# Altium project PCB_Project_2.PrjPcb
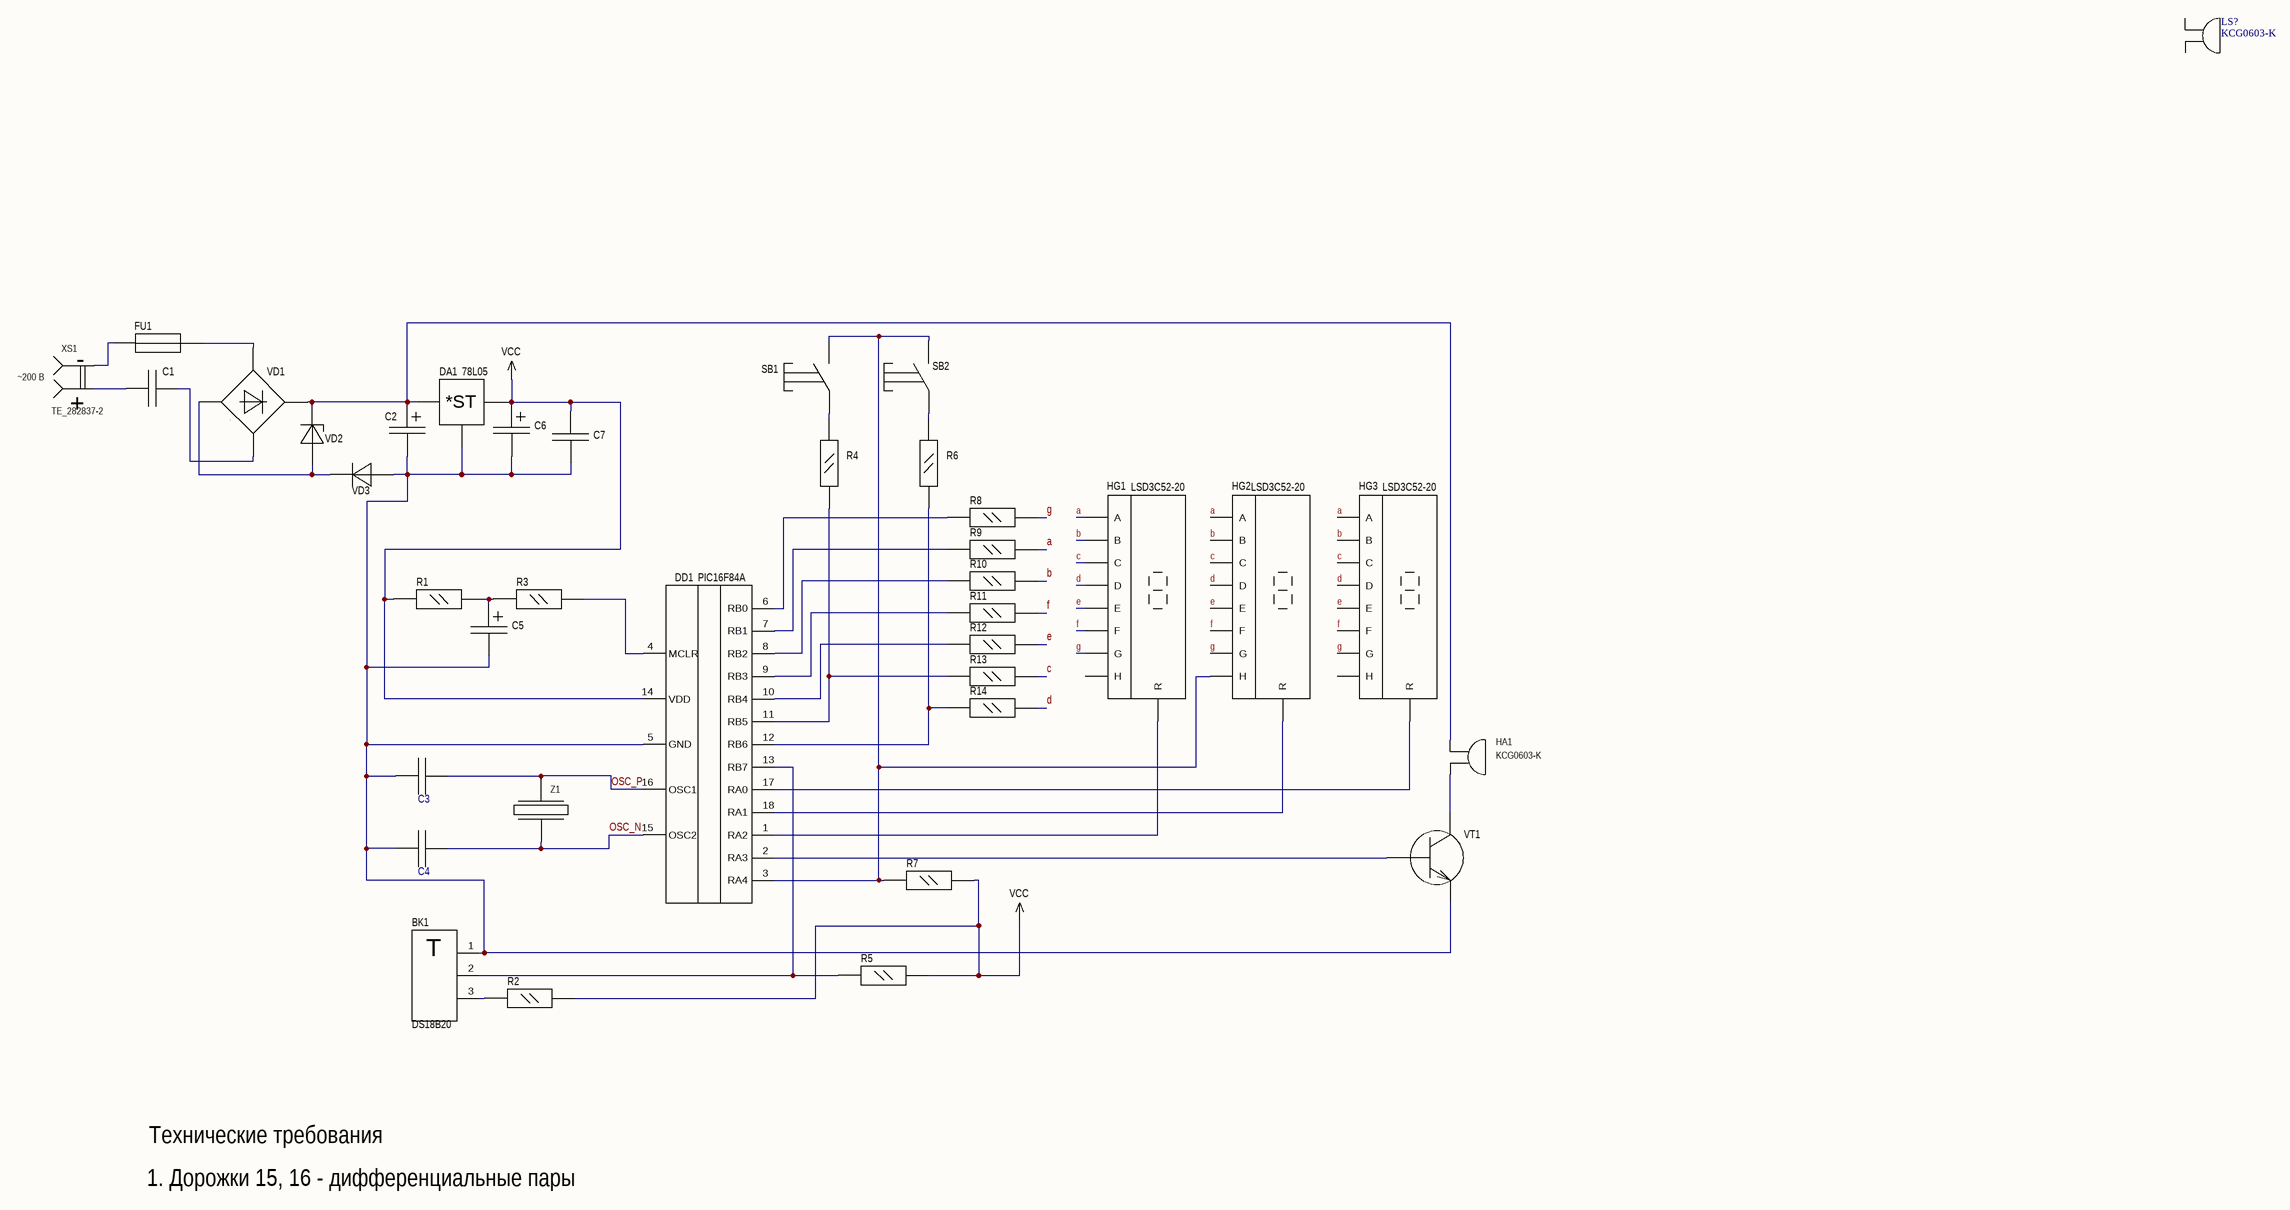
[diagram p0: RomanK1.SchDoc]
1 sheet, 38 parts. Net scope: global (net labels, ports and power ports of the same name join across sheets).
Board file: PCB1.PcbDoc

## Sheet RomanK1.SchDoc: Датчик
size 420 x 297 mm; ApprovedBy: Исаев; CheckedBy: Исаев; DrawnBy: Колганов; Organization: МАИ; DocumentNumber: МВАУ.405113.008 Э3; SheetNumber: 1; SheetTotal: 1; Title1str: температуры; DocumentType: Схема электрическая принципиальная; Format: A3; ImagePath: МВАУ.405113.008

### Parts
BK1  DS18B20  [ds18b20 (Temperature)]
C1  CapacitorBI  [c1 1uF 400v]  (value not drawn)
C2  CapcatiorPOL  [c2 CAP ALUM 470UF 20% 25V SMD]  (value not drawn)
C3  CapacitorBI  [c3 c4 CAPC1608X90]  (value not drawn)
C4  CapacitorBI  [c3 c4 CAPC1608X90]  (value not drawn)
C5  CapcatiorPOL  [Polar CAPACITOR]  (value not drawn)
C6  CapcatiorPOL  [c6 CAP ALUM 1000UF 20% 16V SMD]  (value not drawn)
C7  CapacitorBI  [CAPACITOR]  (value not drawn)
DA1  78L05  [78lo5]
DD1  PIC16F84A  [PIC16F84A]
FU1  Fuse box  [SMD06025C2 (Плавкий предохранитель)]  (value not drawn)
HA1  KCG0603-K  [KCG0603-K Пищалка]
HG1  LSD3C52-20  [LSD3C52-20 (7 segment)]
HG2  LSD3C52-20  [LSD3C52-20 (7 segment)]
HG3  LSD3C52-20  [LSD3C52-20 (7 segment)]
LS?  KCG0603-K  [KCG0603-K Пищалка]
R1  resistor  [RES 0805]  (value not drawn)
R2  resistor  [RES 0805]  (value not drawn)
R3  resistor  [RES 0805]  (value not drawn)
R4  resistor  [RES 0805]  (value not drawn)
R5  resistor  [RES 0805]  (value not drawn)
R6  resistor  [RES 0805]  (value not drawn)
R7  resistor  [RES 0805]  (value not drawn)
R8  resistor  [RES 0805]  (value not drawn)
R9  resistor  [RES 0805]  (value not drawn)
R10  resistor  [RES 0805]  (value not drawn)
R11  resistor  [RES 0805]  (value not drawn)
R12  resistor  [RES 0805]  (value not drawn)
R13  resistor  [RES 0805]  (value not drawn)
R14  resistor  [RES 0805]  (value not drawn)
SB1  Button  [SW_800AWSP9M2QE (button)]  (value not drawn)
SB2  Button  [SW_800AWSP9M2QE (button)]  (value not drawn)
VD1  diode bridge  [КЦ407А (Диодный мост)]  (value not drawn)
VD2  Stabilitron  [Стабилитрон DIOM5436X247N]  (value not drawn)
VD3  Diod  [Диод US1A-13-F]  (value not drawn)
VT1  transistor  [КТ315Б]  (value not drawn)
XS1  TE_282837-2  [Питание TE_282837-2]
Z1  kwarz  [Кварц  hc-49sm]  (value not drawn)

### Nets
VCC: C6.1 C7.1 DA1.1(out) DD1.14(VDD) R1.2 R2.1 R5.1 R7.1
a: HG1.1(A) HG2.1(A) HG3.1(A) R9.1
b: HG1.10(B) HG2.10(B) HG3.10(B) R10.1
c: HG1.8(C) HG2.8(C) HG3.8(C) R13.1
d: HG1.5(D) HG2.5(D) HG3.5(D) R14.1
e: HG1.4(E) HG2.4(E) HG3.4(E) R12.1
f: HG1.2(F) HG2.2(F) HG3.2(F) R11.1
g: HG1.3(G) HG2.3(G) HG3.3(G) R8.1
OSC_N: C4.2 DD1.15(OSC2) Z1.2
OSC_P: C3.1 DD1.16(OSC1) Z1.1
NetBK1_1: BK1.1(GND) C2.2 C3.2 C4.1 C5.2 C6.2 C7.2 DA1.2(gnd) DD1.5(GND) VD3.1 VT1.3
NetBK1_2: BK1.2(DQ) DD1.13(RB7) R5.2
NetBK1_3: BK1.3(VDD) R2.2
NetC1_1: C1.1 XS1.2(+)
NetC1_2: C1.2 VD1.5
NetC2_1: C2.1 DA1.3(in) HA1.1(POS) VD1.4(3_or_4) VD2.2
NetC5_1: C5.1 R1.1 R3.2
NetDD1_1: DD1.1(RA2) HG1.6(R)
NetDD1_2: DD1.2(RA3) VT1.1
NetDD1_3: DD1.3(RA4) HG2.7(H) R7.2 SB1.2 SB2.2
NetDD1_4: DD1.4(MCLR) R3.1
NetDD1_6: DD1.6(RB0) R8.2
NetDD1_7: DD1.7(RB1) R9.2
NetDD1_8: DD1.8(RB2) R10.2
NetDD1_9: DD1.9(RB3) R11.2
NetDD1_10: DD1.10(RB4) R12.2
NetDD1_11: DD1.11(RB5) R4.2 R13.2
NetDD1_12: DD1.12(RB6) R6.2 R14.2
NetDD1_17: DD1.17(RA0) HG3.6(R)
NetDD1_18: DD1.18(RA1) HG2.6(R)
NetFU1_1: FU1.1 XS1.1(-)
NetFU1_2: FU1.2 VD1.2
NetHA1_2: HA1.2(NEG) VT1.2
NetR4_1: R4.1 SB1.1
NetR6_1: R6.1 SB2.1
NetVD1_1: VD1.1(1_or_6) VD2.1 VD3.2

Not connected (* = marked no-connect by the designer): HG1 7(H); HG3 7(H); LS? 1(POS) 2(NEG)

### Notes on the sheet
- (near XS1) ~200 В
- Технические требования
- 1. Дорожки 15, 16 - дифференциальные пары
- Перв. примен.
- Справ. №
- Подп. и дата
- Инв. № дубл.
- Нормоконтроль:
- Взам. инв. №
- Изм.
- Лист
- № докум.
- Подп.
- Дата
- Лит.
- Масса
- Масштаб
- Т.контр.
- Пров.
- Разраб.
- Листов
- Разработал:
- Инв. № подл.
- Н.контр.
- Утв.
- Копировал
- Формат
- (in symbol 78L05) *ST
- (in symbol DS18B20) T

### Library data of the parts
HA1 LS? = KCG0603-K: Magnetic Transducer Passive Buzzer [Kingstate], Pin Type, Dimensions(mm): 6.60*3.50, Voltage: 2.0~5.0, Max current consumption(mA): Max. 80, Coil resistance(Î©): 16.0Â±3.0, SPL(dB): Min. 75dB(Typical 80)@10cm, Frequency(KHz): 3.00.; Price: None; SnapEDA_Link: https://www.snapeda.com/parts/KCG0603-K/Kingstate/view-part/?ref=snap; MF: Kingstate; Check_prices: https://www.snapeda.com/parts/KCG0603-K/Kingstate/view-part/?ref=eda; Package: None; Availability: In Stock; Value: *; MP: KCG0603-K